# EAGLE design FLC-148 side connector panel (EAGLE 9.4.0)
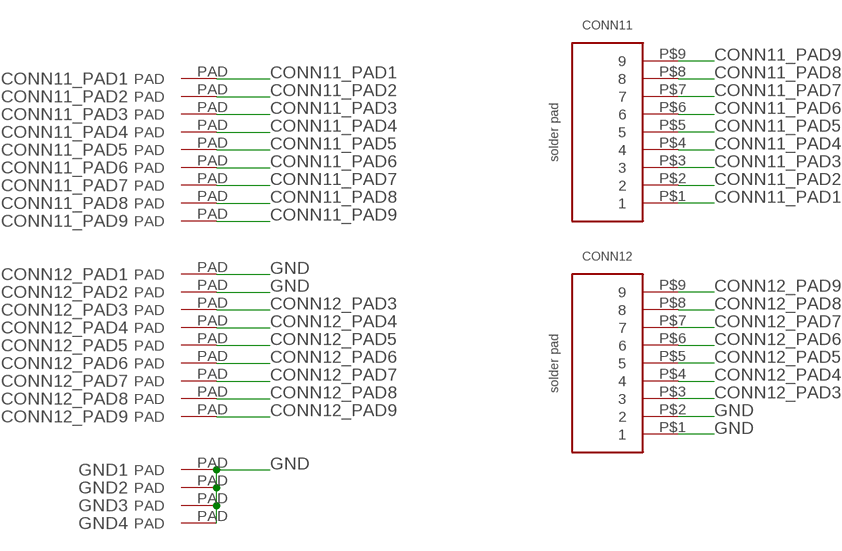
[diagram p0: schematic, sheet 1]

## Parts
CONN11  solder pad  FFC_1MM_9P  [FFC_1MM_9P]
CONN11_PAD1  PAD  [PAD]
CONN11_PAD2  PAD  [PAD]
CONN11_PAD3  PAD  [PAD]
CONN11_PAD4  PAD  [PAD]
CONN11_PAD5  PAD  [PAD]
CONN11_PAD6  PAD  [PAD]
CONN11_PAD7  PAD  [PAD]
CONN11_PAD8  PAD  [PAD]
CONN11_PAD9  PAD  [PAD]
CONN12  solder pad  FFC_1MM_9P  [FFC_1MM_9P]
CONN12_PAD1  PAD  [PAD]
CONN12_PAD2  PAD  [PAD]
CONN12_PAD3  PAD  [PAD]
CONN12_PAD4  PAD  [PAD]
CONN12_PAD5  PAD  [PAD]
CONN12_PAD6  PAD  [PAD]
CONN12_PAD7  PAD  [PAD]
CONN12_PAD8  PAD  [PAD]
CONN12_PAD9  PAD  [PAD]
GND1  PAD  [PAD]
GND2  PAD  [PAD]
GND3  PAD  [PAD]
GND4  PAD  [PAD]

## Nets
CONN11_PAD1 [signal]: CONN11.P$1 CONN11_PAD1.PAD
CONN11_PAD2 [signal]: CONN11.P$2 CONN11_PAD2.PAD
CONN11_PAD3 [signal]: CONN11.P$3 CONN11_PAD3.PAD
CONN11_PAD4 [signal]: CONN11.P$4 CONN11_PAD4.PAD
CONN11_PAD5 [signal]: CONN11.P$5 CONN11_PAD5.PAD
CONN11_PAD6 [signal]: CONN11.P$6 CONN11_PAD6.PAD
CONN11_PAD7 [signal]: CONN11.P$7 CONN11_PAD7.PAD
CONN11_PAD8 [signal]: CONN11.P$8 CONN11_PAD8.PAD
CONN11_PAD9 [Vcc]: CONN11.P$9 CONN11_PAD9.PAD
CONN12_PAD3 [signal]: CONN12.P$3 CONN12_PAD3.PAD
CONN12_PAD4 [signal]: CONN12.P$4 CONN12_PAD4.PAD
CONN12_PAD5 [signal]: CONN12.P$5 CONN12_PAD5.PAD
CONN12_PAD6 [signal]: CONN12.P$6 CONN12_PAD6.PAD
CONN12_PAD7 [signal]: CONN12.P$7 CONN12_PAD7.PAD
CONN12_PAD8 [signal]: CONN12.P$8 CONN12_PAD8.PAD
CONN12_PAD9 [signal]: CONN12.P$9 CONN12_PAD9.PAD
GND: CONN12.P$1 CONN12.P$2 CONN12_PAD1.PAD CONN12_PAD2.PAD GND1.PAD GND2.PAD GND3.PAD GND4.PAD

## Library data of the parts
CONN11 CONN12 = FFC solder pad pitch 1mm 9p:FFC_1MM_9P
CONN11_PAD1-CONN11_PAD9 CONN12_PAD1-CONN12_PAD9 GND1-GND4 = round pad:PAD

## Net classes
0 GND: width 0.2 mm, drill 0.3 mm, clearance 0.25 mm
1 Vcc: width 0.3 mm, drill 0.3 mm, clearance 0.25 mm
2 signal: width 0.2 mm, drill 0.3 mm, clearance 0.25 mm

## Board
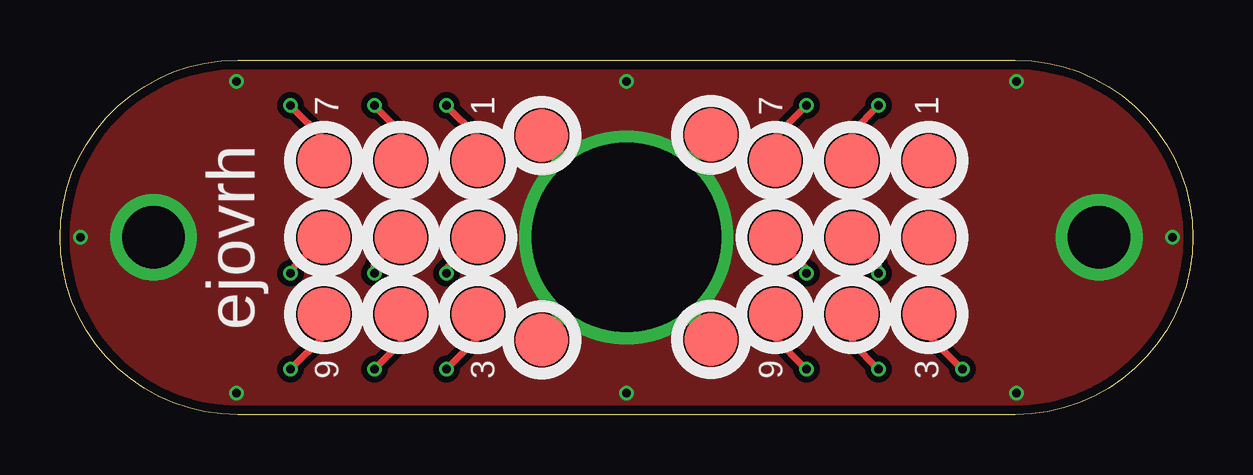
[diagram p1: board, top side]
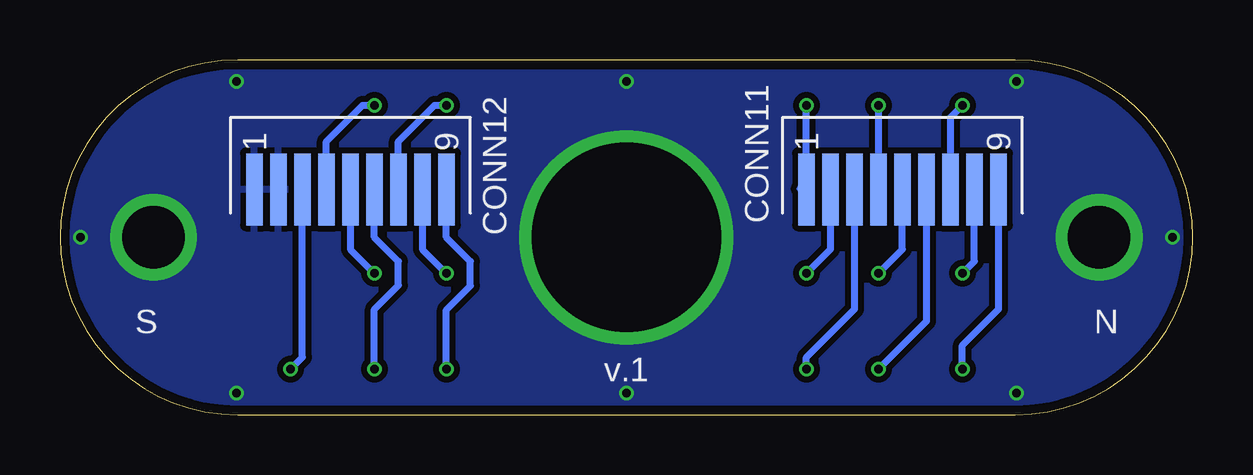
[diagram p2: board, bottom side, seen from below]

Size 47.2 x 14.8 mm. Coordinates in mm from the lower left corner, seen from the top.
Outline: 47.2,7.4 arc-90 39.8,0 7.4,0 arc-90 0,7.4 arc-90 7.4,14.8 39.8,14.8 arc-90 47.2,7.4
Copper layers (1*16): Top 0.035559375mm / dielectric 1.6mm / Bottom 0.035559375mm
Design rules "oshpark-2layer": minimum track width 6mil, minimum drill 10mil, track to track 6mil, track to pad 6mil, pad to pad 6mil, via to via 6mil, smd to smd 6mil, copper to edge 15mil, drill to drill 6mil, minimum pad ring 5mil, minimum via ring 5mil, stop-mask expansion 2.5mil, vias tented up to drill 0mil, thermal gap 10mil

### Footprints (pad centres in the part's own frame; a part is rotated, then mirrored left to right if it is on the bottom)
FFC_1MM_9P = smd 3 x 0.7: P$1 2,-4; P$2 2,-3; P$3 2,-2; P$4 2,-1; P$5 2,0; P$6 2,1; P$7 2,2; P$8 2,3; P$9 2,4
PAD = smd 2.2 x 2.2: PAD 0,0

### Placement (x,y rotation side)
CONN11  12.1,11.4 270 bottom
CONN11_PAD1  17.4,10.6 0 top
CONN11_PAD2  17.4,7.4 0 top
CONN11_PAD3  17.4,4.2 0 top
CONN11_PAD4  14.2,10.6 0 top
CONN11_PAD5  14.2,7.4 0 top
CONN11_PAD6  14.2,4.2 0 top
CONN11_PAD7  11,10.6 0 top
CONN11_PAD8  11,7.4 0 top
CONN11_PAD9  11,4.2 0 top
CONN12  35.1,11.4 270 bottom
CONN12_PAD1  36.2,10.6 0 top
CONN12_PAD2  36.2,7.4 0 top
CONN12_PAD3  36.2,4.2 0 top
CONN12_PAD4  33,10.6 0 top
CONN12_PAD5  33,7.4 0 top
CONN12_PAD6  33,4.2 0 top
CONN12_PAD7  29.8,10.6 0 top
CONN12_PAD8  29.8,7.4 0 top
CONN12_PAD9  29.8,4.2 0 top
GND1  27.12,3.15 180 top
GND2  27.12,11.68 180 top
GND3  20.08,3.12 180 top
GND4  20.08,11.65 180 top

### Tracks (layer width: path | path; a pad name or v marks a point on that pad's centre or on a via)
CONN11_PAD1  (via drill 0.35)
  Top 0.3: CONN11_PAD1.PAD 17.4,11.6 v16.1,12.9
  Bottom 0.3: CONN11.P$1 16.35,9.4 16.35,9.45 16.1,9.7 v16.1,12.9
CONN11_PAD2  (via drill 0.35)
  Top 0.3: CONN11_PAD2.PAD 16.1,6.1 v16.1,5.9
  Bottom 0.3: CONN11.P$2 15.1,6.9 v16.1,5.9
CONN11_PAD3  (via drill 0.35)
  Top 0.3: CONN11_PAD3.PAD 17.4,3.2 v16.1,1.9
  Bottom 0.3: v16.1,1.9 16.1,2.4 14.1,4.4 CONN11.P$3
CONN11_PAD4  (via drill 0.35)
  Top 0.3: v13.1,12.9 14.2,11.8 CONN11_PAD4.PAD
  Bottom 0.3: v13.1,12.9 CONN11.P$4
CONN11_PAD5  (via drill 0.35)
  Top 0.3: v13.1,5.9 13.1,6.3 CONN11_PAD5.PAD
  Bottom 0.3: v13.1,5.9 12.1,6.9 CONN11.P$5
CONN11_PAD6  (via drill 0.35)
  Top 0.3: CONN11_PAD6.PAD 14.2,3 v13.1,1.9
  Bottom 0.3: v13.1,1.9 11.1,3.9 CONN11.P$6
CONN11_PAD7  (via drill 0.35)
  Top 0.3: v9.6,12.9 11,11.5 CONN11_PAD7.PAD
  Bottom 0.3: CONN11.P$7 10.1,12.4 v9.6,12.9
CONN11_PAD8  (via drill 0.35)
  Top 0.3: CONN11_PAD8.PAD 9.6,6 v9.6,5.9
  Bottom 0.3: v9.6,5.9 9.1,6.4 CONN11.P$8
CONN11_PAD9  (via drill 0.35)
  Top 0.3: CONN11_PAD9.PAD 11,3.3 v9.6,1.9
  Bottom 0.3: v9.6,1.9 9.6,2.9 8.1,4.4 CONN11.P$9
CONN12_PAD3  (via drill 0.35)
  Top 0.3: CONN12_PAD3.PAD 36.2,3.3 v37.6,1.9
  Bottom 0.3: v37.6,1.9 37.1,2.4 CONN12.P$3
CONN12_PAD4  (via drill 0.35)
  Top 0.3: CONN12_PAD4.PAD 33,11.8 v34.1,12.9
  Bottom 0.3: v34.1,12.9 34.6,12.9 36.1,11.4 CONN12.P$4
CONN12_PAD5  (via drill 0.35)
  Top 0.3: CONN12_PAD5.PAD 34.1,6.3 v34.1,5.9
  Bottom 0.3: CONN12.P$5 35.1,6.9 v34.1,5.9
CONN12_PAD6  (via drill 0.35)
  Top 0.3: CONN12_PAD6.PAD 33,3 v34.1,1.9
  Bottom 0.3: CONN12.P$6 34.1,7.4 33.1,6.4 33.1,5.4 34.1,4.4 v34.1,1.9
CONN12_PAD7  (via drill 0.35)
  Top 0.3: CONN12_PAD7.PAD 29.8,11.6 v31.1,12.9
  Bottom 0.3: v31.1,12.9 31.6,12.9 33.1,11.4 CONN12.P$7
CONN12_PAD8  (via drill 0.35)
  Top 0.3: CONN12_PAD8.PAD 31.1,6.1 v31.1,5.9
  Bottom 0.3: CONN12.P$8 32.1,6.9 v31.1,5.9
CONN12_PAD9  (via drill 0.35)
  Top 0.3: CONN12_PAD9.PAD 29.8,3.2 v31.1,1.9
  Bottom 0.3: CONN12.P$9 31.1,7.4 30.1,6.4 30.1,5.38 31.1,4.38 v31.1,1.9
GND  (via drill 0.35, 2.6, 7.9)
  other vias: 43.3,7.4 3.9,7.4 23.6,7.4 39.85,13.9 46.35,7.4 39.85,0.9 7.35,0.9 0.85,7.4 7.35,13.9 23.6,13.9 23.6,0.9
  pour Top: -1.4,16.4 48.6,16.4 48.6,-1.5 -1.4,-1.5
  pour Bottom: -1.4,16.4 48.6,16.4 48.6,-1.6 -1.4,-1.6

### Text on the board
tPlace: 7 | 1 | 7 | 1 | ejovrh | 9 | 3 | 9 | 3
bPlace: N | S
bNames: v.1